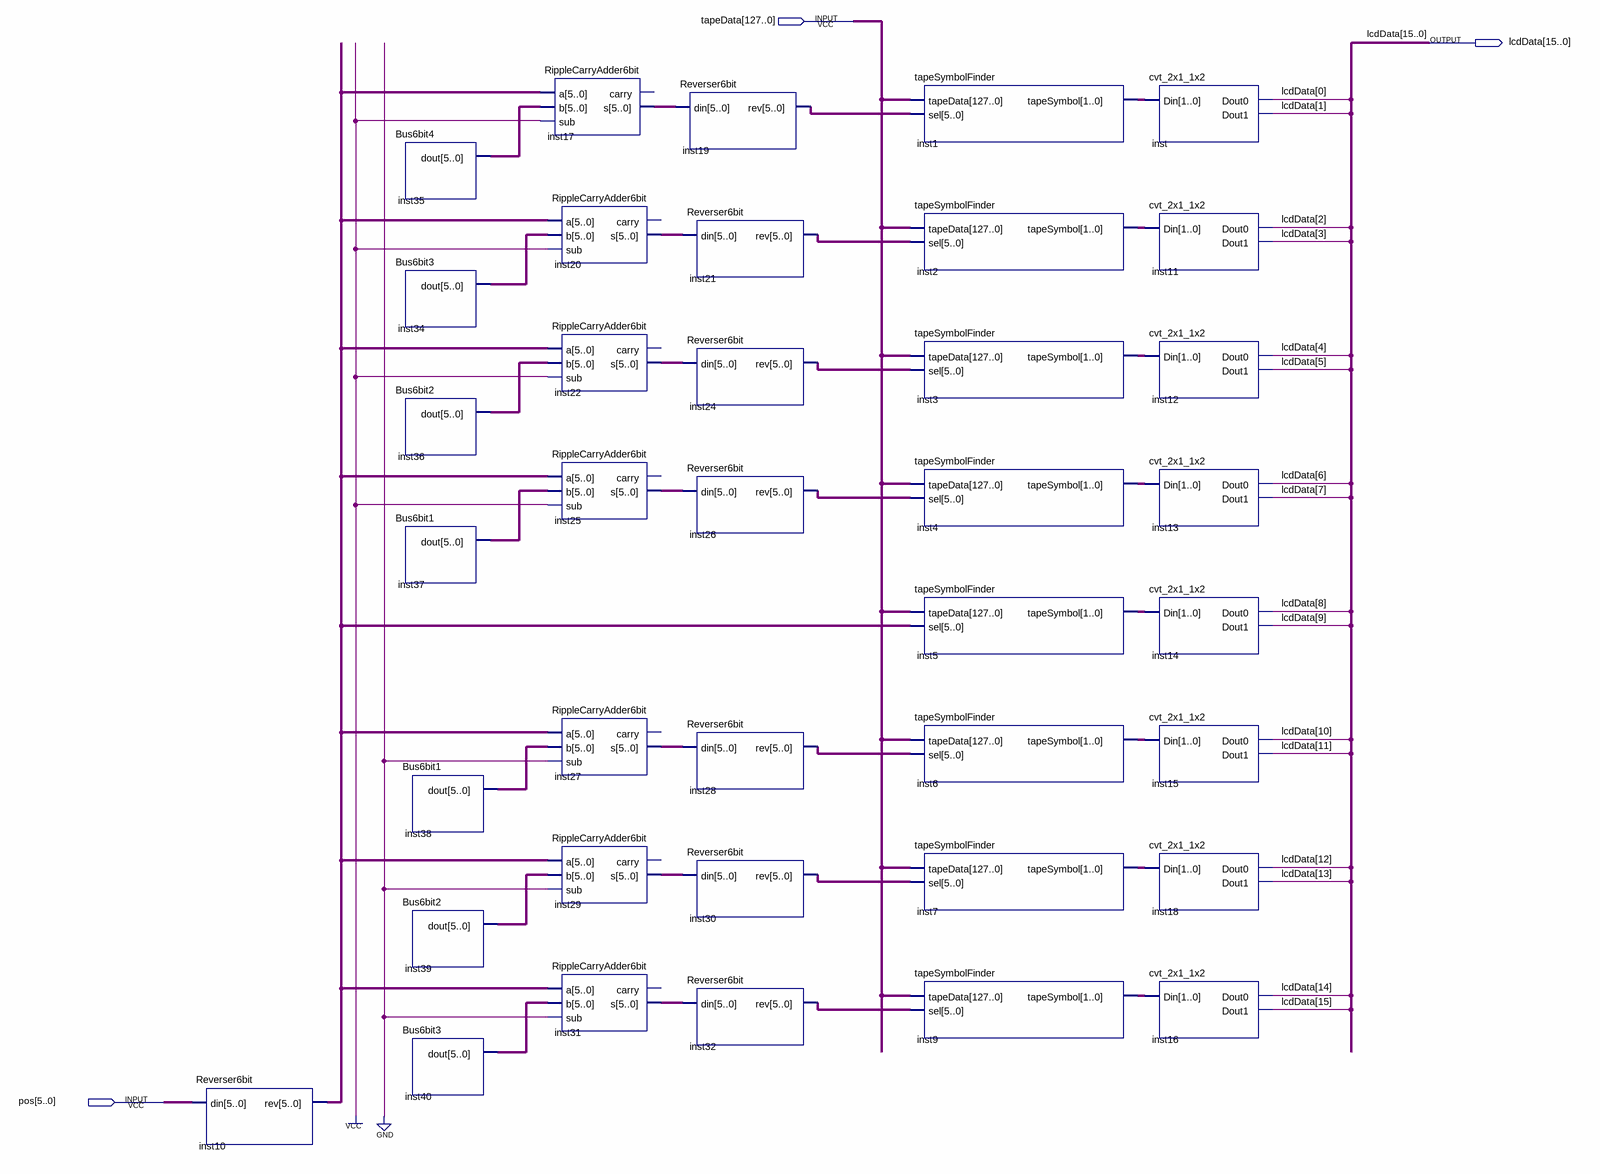
[diagram p0: schematic sheet]
// Quartus schematic window.bdf as structural Verilog: 38 symbols, 3 pins
module window (
  input  [127:0] tapeData,
  input  [5:0] pos,
  output [15:0] lcdData
);

  wire [1:0] inst1_tapesymbol, inst2_tapesymbol, inst3_tapesymbol, inst4_tapesymbol, inst5_tapesymbol,
       inst6_tapesymbol, inst7_tapesymbol, inst9_tapesymbol;
  wire [5:0] inst10_rev, inst17_s, inst19_rev, inst20_s, inst21_rev, inst22_s, inst24_rev, inst25_s,
       inst26_rev, inst27_s, inst28_rev, inst29_s, inst30_rev, inst31_s, inst32_rev, inst34_dout,
       inst35_dout, inst36_dout, inst37_dout, inst38_dout, inst39_dout, inst40_dout;

  Reverser6bit inst10 (.din(pos), .rev(inst10_rev));
  Bus6bit4 inst35 (.dout(inst35_dout));
  Bus6bit3 inst34 (.dout(inst34_dout));
  Bus6bit2 inst36 (.dout(inst36_dout));
  Bus6bit1 inst37 (.dout(inst37_dout));
  Bus6bit1 inst38 (.dout(inst38_dout));
  Bus6bit2 inst39 (.dout(inst39_dout));
  Bus6bit3 inst40 (.dout(inst40_dout));
  RippleCarryAdder6bit inst17 (.a(inst10_rev), .b(inst35_dout), .sub(1'b1), .s(inst17_s));  // open: carry
  RippleCarryAdder6bit inst20 (.a(inst10_rev), .b(inst34_dout), .sub(1'b1), .s(inst20_s));  // open: carry
  RippleCarryAdder6bit inst22 (.a(inst10_rev), .b(inst36_dout), .sub(1'b1), .s(inst22_s));  // open: carry
  RippleCarryAdder6bit inst25 (.a(inst10_rev), .b(inst37_dout), .sub(1'b1), .s(inst25_s));  // open: carry
  RippleCarryAdder6bit inst27 (.a(inst10_rev), .b(inst38_dout), .sub(1'b0), .s(inst27_s));  // open: carry
  RippleCarryAdder6bit inst29 (.a(inst10_rev), .b(inst39_dout), .sub(1'b0), .s(inst29_s));  // open: carry
  RippleCarryAdder6bit inst31 (.a(inst10_rev), .b(inst40_dout), .sub(1'b0), .s(inst31_s));  // open: carry
  Reverser6bit inst19 (.din(inst17_s), .rev(inst19_rev));
  Reverser6bit inst21 (.din(inst20_s), .rev(inst21_rev));
  Reverser6bit inst24 (.din(inst22_s), .rev(inst24_rev));
  Reverser6bit inst26 (.din(inst25_s), .rev(inst26_rev));
  Reverser6bit inst28 (.din(inst27_s), .rev(inst28_rev));
  Reverser6bit inst30 (.din(inst29_s), .rev(inst30_rev));
  Reverser6bit inst32 (.din(inst31_s), .rev(inst32_rev));
  tapeSymbolFinder inst1 (.tapeData(tapeData), .sel(inst19_rev), .tapeSymbol(inst1_tapesymbol));
  tapeSymbolFinder inst2 (.tapeData(tapeData), .sel(inst21_rev), .tapeSymbol(inst2_tapesymbol));
  tapeSymbolFinder inst3 (.tapeData(tapeData), .sel(inst24_rev), .tapeSymbol(inst3_tapesymbol));
  tapeSymbolFinder inst4 (.tapeData(tapeData), .sel(inst26_rev), .tapeSymbol(inst4_tapesymbol));
  tapeSymbolFinder inst5 (.tapeData(tapeData), .sel(inst10_rev), .tapeSymbol(inst5_tapesymbol));
  tapeSymbolFinder inst6 (.tapeData(tapeData), .sel(inst28_rev), .tapeSymbol(inst6_tapesymbol));
  tapeSymbolFinder inst7 (.tapeData(tapeData), .sel(inst30_rev), .tapeSymbol(inst7_tapesymbol));
  tapeSymbolFinder inst9 (.tapeData(tapeData), .sel(inst32_rev), .tapeSymbol(inst9_tapesymbol));
  cvt_2x1_1x2 inst (.Din(inst1_tapesymbol), .Dout0(lcdData[0]), .Dout1(lcdData[1]));
  cvt_2x1_1x2 inst11 (.Din(inst2_tapesymbol), .Dout0(lcdData[2]), .Dout1(lcdData[3]));
  cvt_2x1_1x2 inst12 (.Din(inst3_tapesymbol), .Dout0(lcdData[4]), .Dout1(lcdData[5]));
  cvt_2x1_1x2 inst13 (.Din(inst4_tapesymbol), .Dout0(lcdData[6]), .Dout1(lcdData[7]));
  cvt_2x1_1x2 inst14 (.Din(inst5_tapesymbol), .Dout0(lcdData[8]), .Dout1(lcdData[9]));
  cvt_2x1_1x2 inst15 (.Din(inst6_tapesymbol), .Dout0(lcdData[10]), .Dout1(lcdData[11]));
  cvt_2x1_1x2 inst18 (.Din(inst7_tapesymbol), .Dout0(lcdData[12]), .Dout1(lcdData[13]));
  cvt_2x1_1x2 inst16 (.Din(inst9_tapesymbol), .Dout0(lcdData[14]), .Dout1(lcdData[15]));
endmodule
